# Altium project optic_fiber.PrjPcb
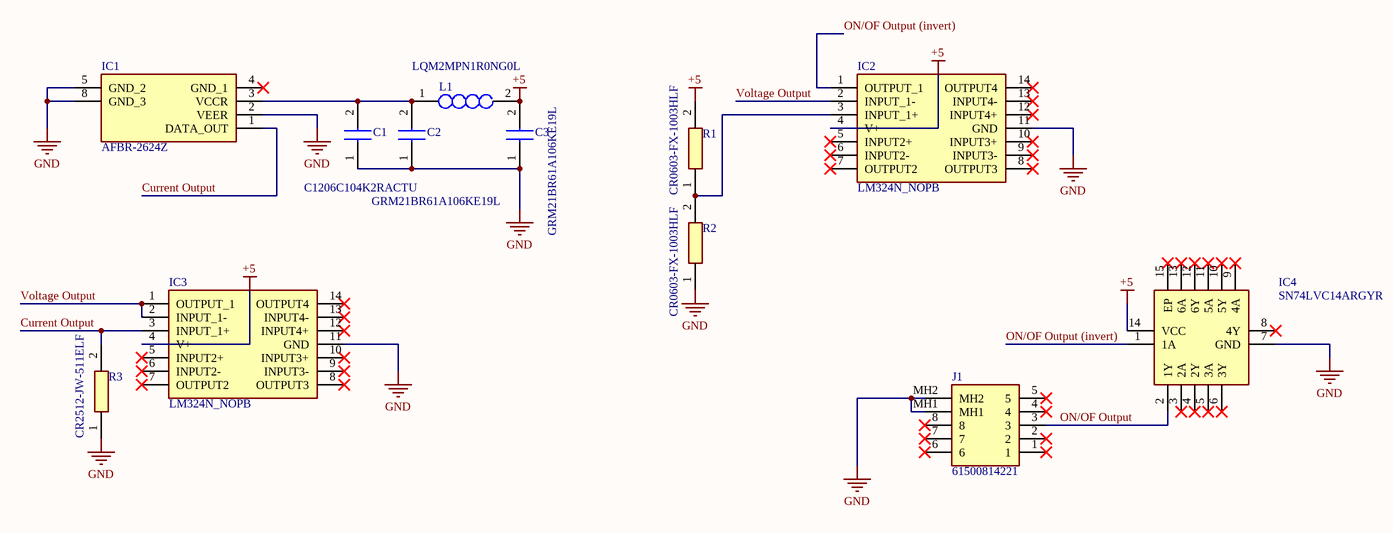
[diagram p0: optic_fiber.SchDoc]
1 sheet, 12 parts. Net scope: global (net labels, ports and power ports of the same name join across sheets).
Board file: optic_fiber.PcbDoc

## Sheet optic_fiber.SchDoc
size A4; SheetNumber: 1; SheetTotal: 1

### Parts
C1  C1206C104K2RACTU  [C1206]
C2  GRM21BR61A106KE19L  [CAPC2012X145N]
C3  GRM21BR61A106KE19L  [CAPC2012X145N]
IC1  AFBR-2624Z  [AFBR2624Z]
IC2  LM324N_NOPB  [DIP794W56P254L1905H533Q14N]
IC3  LM324N_NOPB  [DIP794W56P254L1905H533Q14N]
IC4  SN74LVC14ARGYR  [RGY-(S-PVQFN-N14)]
J1  61500814221  [61500814221]
L1  LQM2MPN1R0NG0L  [LQM2MPN1R0NG0L]
R1  CR0603-FX-1003HLF  [RESC1608X55N]
R2  CR0603-FX-1003HLF  [RESC1608X55N]
R3  CR2512-JW-511ELF  [RESC6331X75N]

### Nets
+5: C3.2 IC2.4(V+) IC3.4(V+) IC4.14(VCC) L1.2 R1.2
GND: C1.1 C2.1 C3.1 IC1.2(VEER) IC1.5(GND_2) IC1.8(GND_3) IC2.11(GND) IC3.11(GND) IC4.7(GND) J1.MH1 J1.MH2 R2.1 R3.1
Current Output: IC1.1(DATA_OUT) IC3.3(INPUT_1+) R3.2
ON/OF Output: IC4.2(1Y) J1.3
ON/OF Output (invert): IC2.1(OUTPUT_1) IC4.1(1A)
Voltage Output: IC2.2(INPUT_1-) IC3.1(OUTPUT_1) IC3.2(INPUT_1-)
NetC1_2: C1.2 C2.2 IC1.3(VCCR) L1.1
NetIC2_3: IC2.3(INPUT_1+) R1.1 R2.2

Not connected (* = marked no-connect by the designer): IC1 4(GND_1)*; IC2 5(INPUT2+)* 6(INPUT2-)* 7(OUTPUT2)* 8(OUTPUT3)* 9(INPUT3-)* 10(INPUT3+)* 12(INPUT4+)* 13(INPUT4-)* 14(OUTPUT4)*; IC3 5(INPUT2+)* 6(INPUT2-)* 7(OUTPUT2)* 8(OUTPUT3)* 9(INPUT3-)* 10(INPUT3+)* 12(INPUT4+)* 13(INPUT4-)* 14(OUTPUT4)*; IC4 3(2A)* 4(2Y)* 5(3A)* 6(3Y)* 8(4Y)* 9(4A)* 10(5Y)* 11(5A)* 12(6Y)* 13(6A)* 15(EP)*; J1 1* 2* 4* 5* 6* 7* 8*

### Library data of the parts
C1 = C1206C104K2RACTU: Capacitor; Manufacturer_Name: KEMET; Datasheet Link: https://content.kemet.com/datasheets/KEM_C1002_X7R_SMD.pdf; Manufacturer_Part_Number: C1206C104K2RACTU; Mouser Part Number: 80-C1206C104K2R; Mouser Price/Stock: https://www.mouser.co.uk/ProductDetail/KEMET/C1206C104K2RACTU?qs=LfA%2FWGvkQbaiouETLouDXw%3D%3D; Arrow Part Number: C1206C104K2RACTU; Arrow Price/Stock: https://www.arrow.com/en/products/c1206c104k2ractu/kemet-corporation
C2 C3 = GRM21BR61A106KE19L: Capacitor; Manufacturer_Name: Murata Electronics; Datasheet Link: http://www.murata.com/~/media/webrenewal/support/library/catalog/products/capacitor/mlcc/c02e.pdf; Height: 1.45mm; Manufacturer_Part_Number: GRM21BR61A106KE19L; Mouser Part Number: 81-GRM21BR61A106KE19; Mouser Price/Stock: https://www.mouser.co.uk/ProductDetail/Murata-Electronics/GRM21BR61A106KE19L?qs=0E7Ycue1i8BtcgA7MBjH8A%3D%3D; Arrow Part Number: GRM21BR61A106KE19L; Arrow Price/Stock: https://www.arrow.com/en/products/grm21br61a106ke19l/murata-manufacturing
IC1 = AFBR-2624Z: Integrated Circuit; Manufacturer_Name: Avago Technologies; Datasheet Link: https://docs.broadcom.com/doc/AV02-4369EN; Height: 7.6mm; Manufacturer_Part_Number: AFBR-2624Z; Mouser Part Number: 630-AFBR-2624Z; Mouser Price/Stock: https://www.mouser.co.uk/ProductDetail/Broadcom-Avago/AFBR-2624Z?qs=60YbxKv0rtDJIJtl89oIpg%3D%3D
IC2 IC3 = LM324N_NOPB: Integrated Circuit; Manufacturer_Name: Texas Instruments; Manufacturer_Part_Number: LM324N/NOPB; Datasheet Link: http://www.ti.com/general/docs/lit/getliterature.tsp?genericPartNumber=LM324-N&fileType=pdf&HQS=ti-null-null-sf-df-pf-sep-wwe&DCM=yes; Height: 5.334mm; Mouser Part Number: 926-LM324N/NOPB; Mouser Price/Stock: https://www.mouser.co.uk/ProductDetail/Texas-Instruments/LM324N-NOPB?qs=X1J7HmVL2ZGOUbLumEeh2Q%3D%3D; Arrow Part Number: LM324N/NOPB; Arrow Price/Stock: https://www.arrow.com/en/products/lm324nnopb/texas-instruments?region=nac
IC4 = SN74LVC14ARGYR: Integrated Circuit; Manufacturer_Name: Texas Instruments; Datasheet Link: http://www.ti.com/lit/gpn/sn74lvc14a; Manufacturer_Part_Number: SN74LVC14ARGYR; Mouser Part Number: 595-SN74LVC14ARGYR; Mouser Price/Stock: https://www.mouser.co.uk/ProductDetail/Texas-Instruments/SN74LVC14ARGYR?qs=xJkDX%2FqrskODEoucJ5DYNg%3D%3D; Arrow Part Number: SN74LVC14ARGYR; Arrow Price/Stock: https://www.arrow.com/en/products/sn74lvc14argyr/texas-instruments?region=nac
J1 = 61500814221: Connector; Manufacturer_Name: Wurth Elektronik; Datasheet Link: http://katalog.we-online.de/em/datasheet/61500814221.pdf; Height: 16.53mm; Manufacturer_Part_Number: 61500814221; Mouser Part Number: 710-61500814221; Mouser Price/Stock: https://www.mouser.co.uk/ProductDetail/Wurth-Elektronik/61500814221?qs=rS3zZhy2AQOW6FITBQg0lg%3D%3D
L1 = LQM2MPN1R0NG0L: Inductor; Manufacturer_Name: Murata Electronics; Datasheet Link: https://psearch.en.murata.com/inductor/product/LQM2MPN1R0NG0%23.html; Height: 1mm; Manufacturer_Part_Number: LQM2MPN1R0NG0L; Mouser Part Number: 81-LQM2MPN1R0NG0L; Mouser Price/Stock: https://www.mouser.co.uk/ProductDetail/Murata-Electronics/LQM2MPN1R0NG0L?qs=%2F%252BYoplLUB5g25EfGJxCkMg%3D%3D; Arrow Part Number: LQM2MPN1R0NG0L; Arrow Price/Stock: https://www.arrow.com/en/products/lqm2mpn1r0ng0l/murata-manufacturing?region=nac
R1 R2 = CR0603-FX-1003HLF: Resistor; Manufacturer_Name: Bourns; Datasheet Link: https://www.bourns.com/pdfs/chpreztr.pdf; Height: 0.55mm; Manufacturer_Part_Number: CR0603-FX-1003HLF; Mouser Part Number: 652-CR0603-FX1003HLF; Mouser Price/Stock: https://www.mouser.com/Search/Refine.aspx?Keyword=652-CR0603-FX1003HLF; Arrow Part Number: CR0603-FX-1003HLF; Arrow Price/Stock: https://www.arrow.com/en/products/cr0603-fx-1003hlf/bourns
R3 = CR2512-JW-511ELF: Resistor; Manufacturer_Name: Bourns; Datasheet Link: https://datasheet.datasheetarchive.com/originals/distributors/SFDatasheet-7/sf-000140163.pdf; Height: 0.75mm; Manufacturer_Part_Number: CR2512-JW-511ELF; Mouser Part Number: 652-CR2512-JW-511ELF; Mouser Price/Stock: https://www.mouser.co.uk/ProductDetail/Bourns/CR2512-JW-511ELF?qs=DRGWdQRZRTUCe2ujtuVbwQ%3D%3D